# Altium project isokey_right.PrjPcb
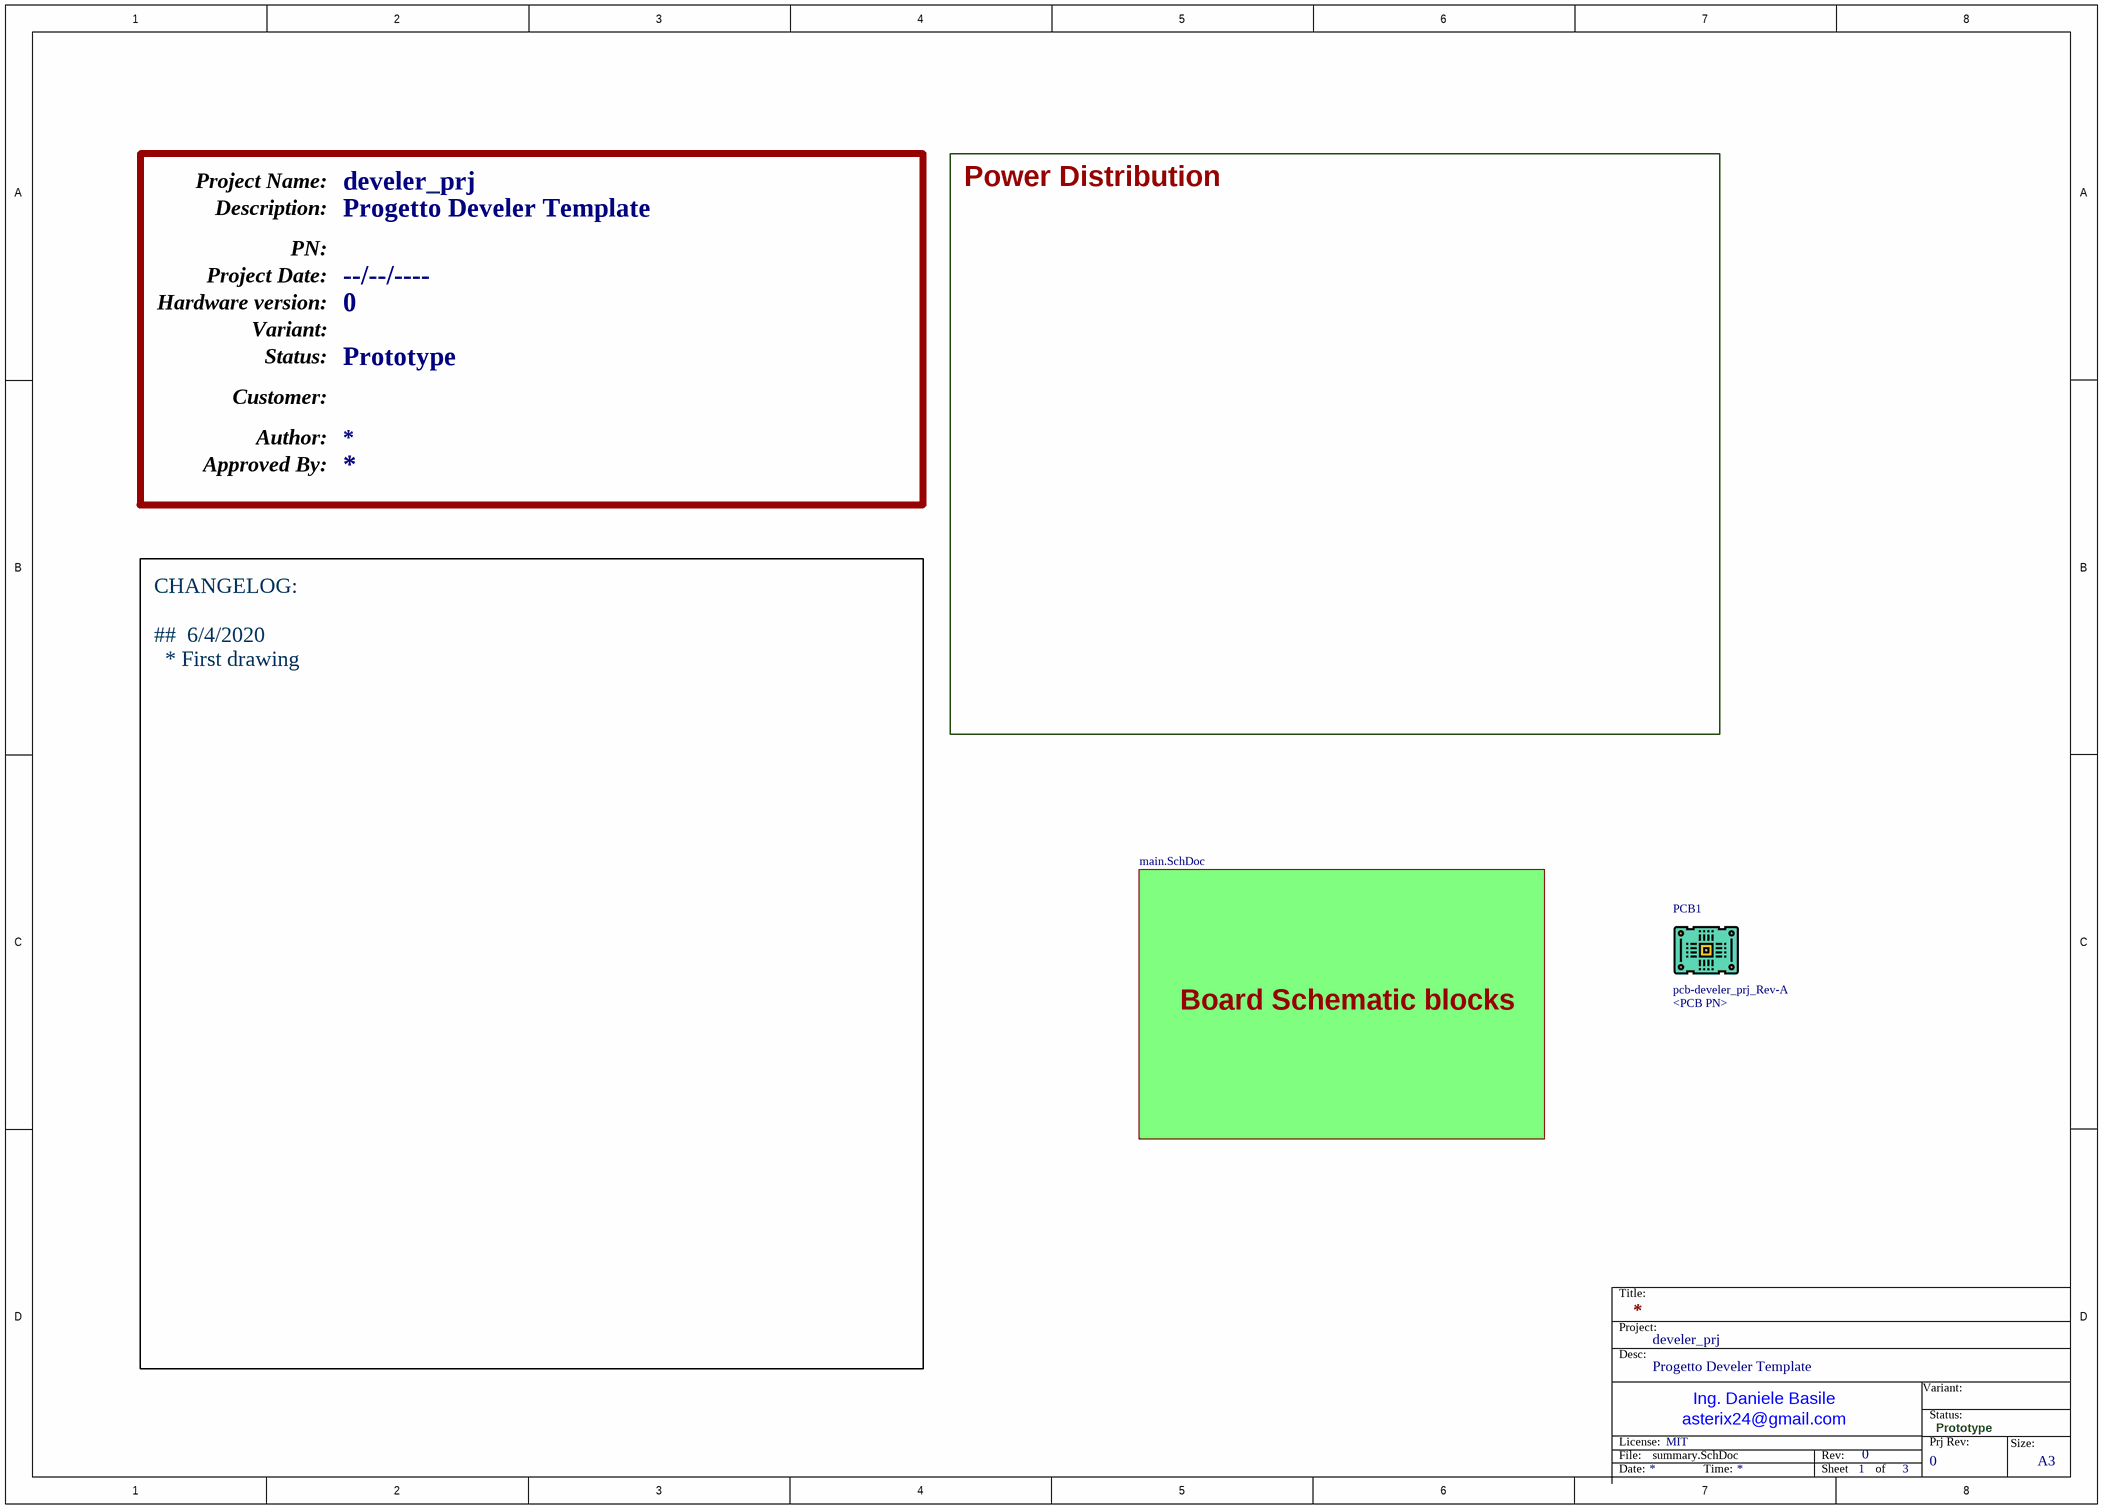
[diagram p0: summary.SchDoc]
prj_status: Prototype; prj_pcb: A; prj_part_number: <PRJ PN>; prj_panel_name: develer_prj_panel; prj_name_long: Progetto Develer Template; prj_name: develer_prj; prj_license: MIT; prj_hw_ver: 0; prj_date: --/--/----; pcb_title2: <TITLE 2>; pcb_title1: <TITLE 1>; pcb_stackup: Default; pcb_solder_color: GREEN; pcb_silkscreen_color: WHITE; pcb_scale: 1:1; pcb_part_number: <PCB PN>; pcb_organization: Develer srl; pcb_material: FR4-Standard Tg 130-140C; pcb_layer_count: 2; pcb_finish: HASL; pcb_engineer_app_date: --/--/----; pcb_engineer: - -----; pcb_dwg_no: <PCB DWG NO>; pcb_designer_app_date: --/--/----; pcb_designer: - -----; pcb_checker_app_date: --/--/----; pcb_checker: - -----; pcb_ang_tol: +/-1/2; pcb_address4: ITALIA; pcb_address3: Firenze; pcb_address2: 50013 Campi Bisenzio; pcb_address1: Via San Quirico 233/3; pcb_3_dec_tol: +/-.010; pcb_2_dec_tol: +/-.01; doc_no_sch_dwg: schematics-xxxx_xxx.pdf; doc_no_fab_dwg: -; doc_no_bom: bom-xxx_xxx.xlsx; doc_no_assy_dwg: assembly-xxxx_xxx.pdf
3 sheets, 169 parts. Net scope: flat (ports and power ports of the same name join across sheets).
Board file: isokey_right.PcbDoc
Sheets:
  summary.SchDoc
     = main.SchDoc
      K00 = key-cell.SchDoc
      K01 = key-cell.SchDoc
      K02 = key-cell.SchDoc
      K03 = key-cell.SchDoc
      K10 = key-cell.SchDoc
      K11 = key-cell.SchDoc
      K12 = key-cell.SchDoc
      K13 = key-cell.SchDoc
      K14 = key-cell.SchDoc
      K20 = key-cell.SchDoc
      K21 = key-cell.SchDoc
      K22 = key-cell.SchDoc
      K23 = key-cell.SchDoc
      K24 = key-cell.SchDoc
      K30 = key-cell.SchDoc
      K31 = key-cell.SchDoc
      K32 = key-cell.SchDoc
      K33 = key-cell.SchDoc
      K40 = key-cell.SchDoc
      K41 = key-cell.SchDoc
      K42 = key-cell.SchDoc
      K43 = key-cell.SchDoc
      K44 = key-cell.SchDoc
      K50 = key-cell.SchDoc
      K51 = key-cell.SchDoc
      K52 = key-cell.SchDoc
      K53 = key-cell.SchDoc
      K60 = key-cell.SchDoc
      K64 = key-cell.SchDoc
      K61 = key-cell.SchDoc
      K62 = key-cell.SchDoc
      K70 = key-cell.SchDoc
      K74 = key-cell.SchDoc
      K72 = key-cell.SchDoc
      K84 = key-cell.SchDoc
      K82 = key-cell.SchDoc
      K73 = key-cell.SchDoc
      K81 = key-cell.SchDoc

## Sheet summary.SchDoc
size A3; Hw_rev: R1; Address3: Firenze; Address4: ITALY; Revision: 0; SheetNumber: 1; SheetTotal: 3

### Parts
PCB1  pcb-develer_prj_Rev-A  CODE Develer: <PCB PN>  (mechanical)

### Sub-sheets
? = main.SchDoc: no entries

### Notes on the sheet
- Project Name:
- Description:
- PN:
- Power Distribution
- Hardware version:
- Project Date:
- Variant:
- Status:
- Author:
- Customer:
- Approved By:
- Board Schematic blocks
- CHANGELOG:
  ##  6/4/2020
  * First drawing
- Title:
- Project:
- Desc:
- File:
- License:
- asterix24@gmail.com
- Ing. Daniele Basile
- Rev:
- Prj Rev:
- Size:
- Date:
- Time:
- Sheet
- of
- A3

### Library data of the parts
PCB1 = PCB: ='['+ pcb_part_number+'], ' + 'pcb-'+prj_name+'_Rev-'+prj_pcb + ', Betamotor'; Publisher: Develer srl; Revision: 0.1; NOTE Manufacturer PN: *; NOTE Manufacturer: *; MountTechnology: *; NOTE Description: *; NOTE Description 2: *

## Sheet main.SchDoc
size A3; Hw_rev: R1; Address3: Firenze; Address4: ITALY; Revision: 0; SheetNumber: 2; SheetTotal: 3
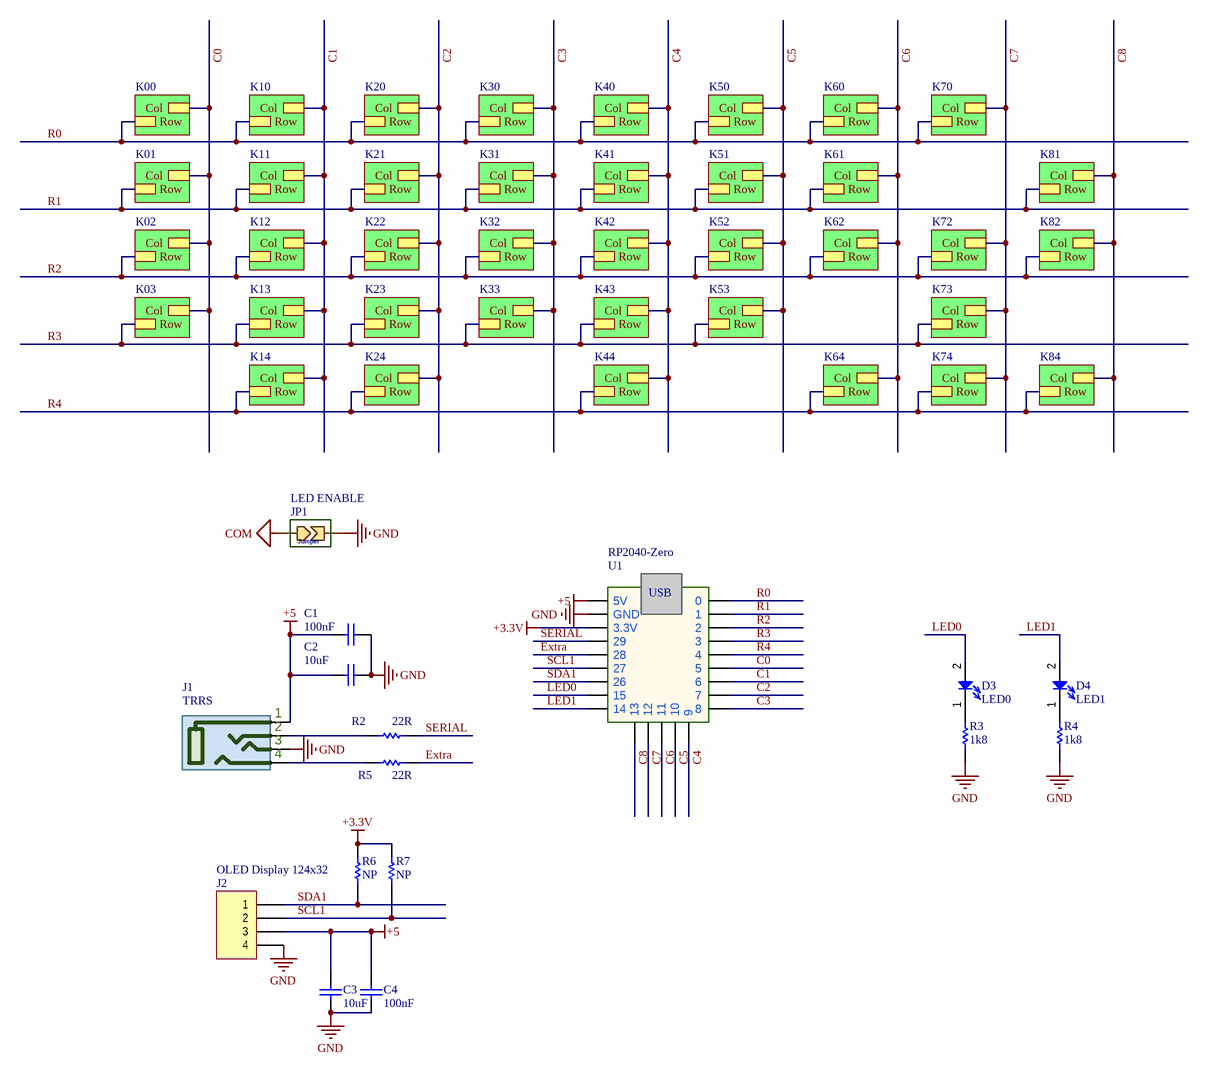
[diagram p1: main.SchDoc]

### Parts
C1  100nF  [0402_[1005]]
C2  10uF  [0603_[1608]]
C3  10uF  [0603_[1608]]
C4  100nF  [0402_[1005]]
D3  LED0  [0402_[1005]_K1-A2_LED]
D4  LED1  [0402_[1005]_K1-A2_LED]
J1  TRRS  [CON_PHONE_TRRS_3.5MM_THD]
J2  OLED Display 124x32  [HEADER_1X4_2.54MM_THD]
JP1  LED ENABLE  [0603_[1608]_JUMPER]
R2  22R  [0402_[1005]]
R3  1k8  [0402_[1005]]
R4  1k8  [0402_[1005]]
R5  22R  [0402_[1005]]
R6  NP  [0402_[1005]]
R7  NP  [0402_[1005]]
U1  RP2040-Zero  [RP2040-Zero]

### Sub-sheets
K00 = key-cell.SchDoc: Col, Row
K01 = key-cell.SchDoc: Col, Row
K02 = key-cell.SchDoc: Col, Row
K03 = key-cell.SchDoc: Col, Row
K10 = key-cell.SchDoc: Col, Row
K11 = key-cell.SchDoc: Col, Row
K12 = key-cell.SchDoc: Col, Row
K13 = key-cell.SchDoc: Col, Row
K14 = key-cell.SchDoc: Col, Row
K20 = key-cell.SchDoc: Col, Row
K21 = key-cell.SchDoc: Col, Row
K22 = key-cell.SchDoc: Col, Row
K23 = key-cell.SchDoc: Col, Row
K24 = key-cell.SchDoc: Col, Row
K30 = key-cell.SchDoc: Col, Row
K31 = key-cell.SchDoc: Col, Row
K32 = key-cell.SchDoc: Col, Row
K33 = key-cell.SchDoc: Col, Row
K40 = key-cell.SchDoc: Col, Row
K41 = key-cell.SchDoc: Col, Row
K42 = key-cell.SchDoc: Col, Row
K43 = key-cell.SchDoc: Col, Row
K44 = key-cell.SchDoc: Col, Row
K50 = key-cell.SchDoc: Col, Row
K51 = key-cell.SchDoc: Col, Row
K52 = key-cell.SchDoc: Col, Row
K53 = key-cell.SchDoc: Col, Row
K60 = key-cell.SchDoc: Col, Row
K61 = key-cell.SchDoc: Col, Row
K62 = key-cell.SchDoc: Col, Row
K64 = key-cell.SchDoc: Col, Row
K70 = key-cell.SchDoc: Col, Row
K72 = key-cell.SchDoc: Col, Row
K73 = key-cell.SchDoc: Col, Row
K74 = key-cell.SchDoc: Col, Row
K81 = key-cell.SchDoc: Col, Row
K82 = key-cell.SchDoc: Col, Row
K84 = key-cell.SchDoc: Col, Row

### Nets
+3.3V: R6.2 R7.2 U1.20(3.3V)
+5: C1.2 C2.2 C3.2 C4.2 J1.1 J2.3 U1.22(5V)
COM: JP1.1
GND: C1.1 C2.1 C3.1 C4.1 J1.3 J2.4 JP1.2 R3.1 R4.1 U1.21(GND)
C0: U1.5 ; sheet K00/Col, sheet K01/Col, sheet K02/Col, sheet K03/Col
C1: U1.6 ; sheet K10/Col, sheet K11/Col, sheet K12/Col, sheet K13/Col, sheet K14/Col
C2: U1.7 ; sheet K20/Col, sheet K21/Col, sheet K22/Col, sheet K23/Col, sheet K24/Col
C3: U1.8 ; sheet K30/Col, sheet K31/Col, sheet K32/Col, sheet K33/Col
C4: U1.9 ; sheet K40/Col, sheet K41/Col, sheet K42/Col, sheet K43/Col, sheet K44/Col
C5: U1.10 ; sheet K50/Col, sheet K51/Col, sheet K52/Col, sheet K53/Col
C6: U1.11 ; sheet K60/Col, sheet K64/Col, sheet K61/Col, sheet K62/Col
C7: U1.12 ; sheet K70/Col, sheet K74/Col, sheet K72/Col, sheet K73/Col
C8: U1.13 ; sheet K84/Col, sheet K82/Col, sheet K81/Col
Extra: R5.1 U1.18(28)
LED0: D3.2(A) U1.15
LED1: D4.2(A) U1.14
R0: U1.0 ; sheet K00/Row, sheet K10/Row, sheet K20/Row, sheet K30/Row, sheet K40/Row, sheet K50/Row, sheet K60/Row, sheet K70/Row
R1: U1.1 ; sheet K01/Row, sheet K11/Row, sheet K21/Row, sheet K31/Row, sheet K41/Row, sheet K51/Row, sheet K61/Row, sheet K81/Row
R2: U1.2 ; sheet K02/Row, sheet K12/Row, sheet K22/Row, sheet K32/Row, sheet K42/Row, sheet K52/Row, sheet K62/Row, sheet K72/Row, sheet K82/Row
R3: U1.3 ; sheet K03/Row, sheet K13/Row, sheet K23/Row, sheet K33/Row, sheet K43/Row, sheet K53/Row, sheet K73/Row
R4: U1.4 ; sheet K14/Row, sheet K24/Row, sheet K44/Row, sheet K64/Row, sheet K74/Row, sheet K84/Row
SCL1: J2.2 R7.1 U1.17(27)
SDA1: J2.1 R6.1 U1.16(26)
SERIAL: R2.1 U1.19(29)
NetD3_1: D3.1(K) R3.2
NetD4_1: D4.1(K) R4.2
NetJ1_2: J1.2 R2.2
NetJ1_4: J1.4 R5.2

### Notes on the sheet
- Title:
- Project:
- Desc:
- Variant:
- File:
- License:
- asterix24@gmail.com
- Ing. Daniele Basile
- Rev:
- Prj Rev:
- Status:
- Size:
- Date:
- Time:
- Sheet
- of
- A3
- (in symbol JumperSMD) Jumper
- (in symbol RP2040-Zero) USB

### Library data of the parts
C1-C4 = Cap: Capacitor; NOTE Manufacturer PN: *; NOTE Manufacturer: *; MountTechnology: *; CODE Develer: *; ComponentLink1Description: New link; ComponentLink1URL: *; NOTE Description: *; NOTE Description 2: *
  C1 C4: Value: 100nF
  C2 C3: Value: 10uF
D3 D4 = DiodeLedSmall: Diode Led; Publisher: Develer srl; Revision: 0.1; NOTE Manufacturer PN: *; NOTE Manufacturer: *; MountTechnology: SMT; CODE Develer: *; NOTE Description: *; NOTE Description 2: *
J1 = CON_PHONE_JACK_TSSR: headphone socket TRRS (Hong Cheng HC-PJ-320A); Publisher: Develer srl; Revision: 0.1; NOTE Manufacturer PN: *; NOTE Manufacturer: *; MountTechnology: SMT; CODE Develer: *; NOTE Description: *; NOTE Description 2: *
J2 = Header 4: Header, 4-Pin; LatestRevisionDate: 17-Jul-2002; LatestRevisionNote: Re-released for DXP Platform.; Publisher: Altium Limited
JP1 = JumperSMD: Jumper SMD; Publisher: Develer srl; Revision: 0.1; NOTE Manufacturer PN: *; NOTE Manufacturer: *; MountTechnology: SMT; CODE Develer: *; NOTE Description: *; NOTE Description 2: *
R2-R7 = Res: Resistor; Publisher: Develer srl; Revision: 0.1; NOTE Manufacturer PN: *; NOTE Manufacturer: *; MountTechnology: SMT; CODE Develer: *; NOTE Description: *; NOTE Description 2: *
U1 = RP2040-Zero: module, mini based on RP4020 (RP2350-Zero); Publisher: Develer srl; Revision: 0.1; NOTE Manufacturer PN: *; NOTE Manufacturer: *; MountTechnology: SMT; CODE Develer: *; NOTE Description: *; NOTE Description 2: *

## Sheet key-cell.SchDoc
size A3; Hw_rev: R1; Address3: Firenze; Address4: ITALY; Revision: 0; SheetNumber: 3; SheetTotal: 3
Used 38 times, as channels /K00, /K01, /K02, /K03, /K10, /K11, /K12, /K13, /K14, /K20, /K21, /K22, /K23, /K24, /K30, /K31, /K32, /K33, /K40, /K41, /K42, /K43, /K44, /K50, /K51, /K52, /K53, /K60, /K64, /K61, /K62, /K70, /K74, /K72, /K84, /K82, /K73, /K81. Parts and nets are listed once, with the designators drawn on the sheet.
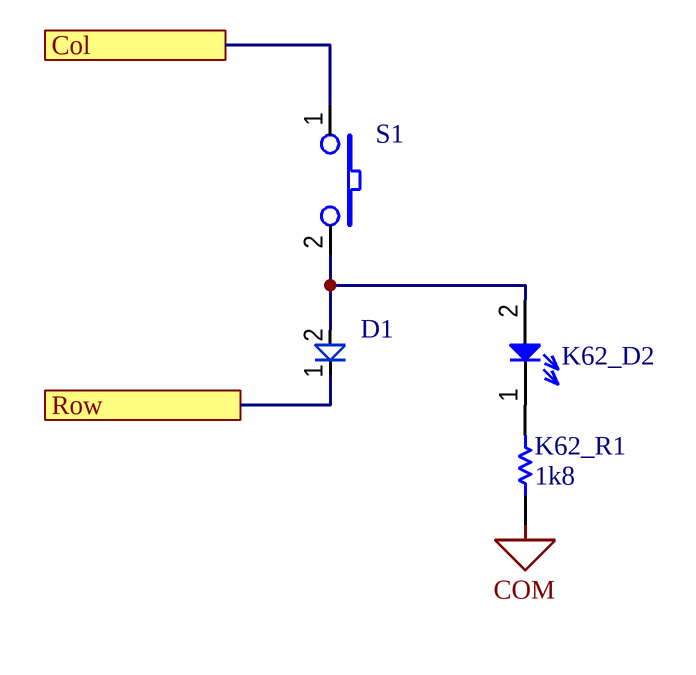
[diagram p2: key-cell.SchDoc]

### Parts
D1  B5819W  [SOD-123_K1-A2]  (value not drawn)
K62_D2  K  [0402_[1005]_K1-A2_LED]  (value not drawn)
K62_R1  1k8  [0402_[1005]]
S1  MecSwitch  [tactile_switch_gateron_pcb]  (value not drawn)

### Ports
Col, Row

### Nets
COM: K62_R1.1
Col: S1.1 ; port Col
Row: D1.1(K) ; port Row
NetD1_2: D1.2(A) K62_D2.2(A) S1.2
NetK62_D2_1: K62_D2.1(K) K62_R1.2

Not connected (* = marked no-connect by the designer): S1 3(GND) 4(GND)

### Channels
/K00: designators D1=K00_D1 K62_D2=K00_D2 K62_R1=K00_R1 S1=K00_S1; ports Col=NetK00_S1_1 Row=NetK00_D1_1
/K01: designators D1=K01_D1 K62_D2=K01_D2 K62_R1=K01_R1 S1=K01_S1; ports Col=NetK00_S1_1 Row=NetK00_D1_1
/K02: designators D1=K02_D1 K62_D2=K02_D2 K62_R1=K02_R1 S1=K02_S1; ports Col=NetK00_S1_1 Row=NetK00_D1_1
/K03: designators D1=K03_D1 K62_D2=K03_D2 K62_R1=K03_R1 S1=K03_S1; ports Col=NetK00_S1_1 Row=NetK00_D1_1
/K10: designators D1=K10_D1 K62_D2=K10_D2 K62_R1=K10_R1 S1=K10_S1; ports Col=NetK00_S1_1 Row=NetK00_D1_1
/K11: designators D1=K11_D1 K62_D2=K11_D2 K62_R1=K11_R1 S1=K11_S1; ports Col=NetK00_S1_1 Row=NetK00_D1_1
/K12: designators D1=K12_D1 K62_D2=K12_D2 K62_R1=K12_R1 S1=K12_S1; ports Col=NetK00_S1_1 Row=NetK00_D1_1
/K13: designators D1=K13_D1 K62_D2=K13_D2 K62_R1=K13_R1 S1=K13_S1; ports Col=NetK00_S1_1 Row=NetK00_D1_1
/K14: designators D1=K14_D1 K62_D2=K14_D2 K62_R1=K14_R1 S1=K14_S1; ports Col=NetK00_S1_1 Row=NetK00_D1_1
/K20: designators D1=K20_D1 K62_D2=K20_D2 K62_R1=K20_R1 S1=K20_S1; ports Col=NetK00_S1_1 Row=NetK00_D1_1
/K21: designators D1=K21_D1 K62_D2=K21_D2 K62_R1=K21_R1 S1=K21_S1; ports Col=NetK00_S1_1 Row=NetK00_D1_1
/K22: designators D1=K22_D1 K62_D2=K22_D2 K62_R1=K22_R1 S1=K22_S1; ports Col=NetK00_S1_1 Row=NetK00_D1_1
/K23: designators D1=K23_D1 K62_D2=K23_D2 K62_R1=K23_R1 S1=K23_S1; ports Col=NetK00_S1_1 Row=NetK00_D1_1
/K24: designators D1=K24_D1 K62_D2=K24_D2 K62_R1=K24_R1 S1=K24_S1; ports Col=NetK00_S1_1 Row=NetK00_D1_1
/K30: designators D1=K30_D1 K62_D2=K30_D2 K62_R1=K30_R1 S1=K30_S1; ports Col=NetK00_S1_1 Row=NetK00_D1_1
/K31: designators D1=K31_D1 K62_D2=K31_D2 K62_R1=K31_R1 S1=K31_S1; ports Col=NetK00_S1_1 Row=NetK00_D1_1
/K32: designators D1=K32_D1 K62_D2=K32_D2 K62_R1=K32_R1 S1=K32_S1; ports Col=NetK00_S1_1 Row=NetK00_D1_1
/K33: designators D1=K33_D1 K62_D2=K33_D2 K62_R1=K33_R1 S1=K33_S1; ports Col=NetK00_S1_1 Row=NetK00_D1_1
/K40: designators D1=K40_D1 K62_D2=K40_D2 K62_R1=K40_R1 S1=K40_S1; ports Col=NetK00_S1_1 Row=NetK00_D1_1
/K41: designators D1=K41_D1 K62_D2=K41_D2 K62_R1=K41_R1 S1=K41_S1; ports Col=NetK00_S1_1 Row=NetK00_D1_1
/K42: designators D1=K42_D1 K62_D2=K42_D2 K62_R1=K42_R1 S1=K42_S1; ports Col=NetK00_S1_1 Row=NetK00_D1_1
/K43: designators D1=K43_D1 K62_D2=K43_D2 K62_R1=K43_R1 S1=K43_S1; ports Col=NetK00_S1_1 Row=NetK00_D1_1
/K44: designators D1=K44_D1 K62_D2=K44_D2 K62_R1=K44_R1 S1=K44_S1; ports Col=NetK00_S1_1 Row=NetK00_D1_1
/K50: designators D1=K50_D1 K62_D2=K50_D2 K62_R1=K50_R1 S1=K50_S1; ports Col=NetK00_S1_1 Row=NetK00_D1_1
/K51: designators D1=K51_D1 K62_D2=K51_D2 K62_R1=K51_R1 S1=K51_S1; ports Col=NetK00_S1_1 Row=NetK00_D1_1
/K52: designators D1=K52_D1 K62_D2=K52_D2 K62_R1=K52_R1 S1=K52_S1; ports Col=NetK00_S1_1 Row=NetK00_D1_1
/K53: designators D1=K53_D1 K62_D2=K53_D2 K62_R1=K53_R1 S1=K53_S1; ports Col=NetK00_S1_1 Row=NetK00_D1_1
/K60: designators D1=K60_D1 K62_D2=K60_D2 K62_R1=K60_R1 S1=K60_S1; ports Col=NetK00_S1_1 Row=NetK00_D1_1
/K64: designators D1=K64_D1 K62_D2=K64_D2 K62_R1=K64_R1 S1=K64_S1; ports Col=NetK00_S1_1 Row=NetK00_D1_1
/K61: designators D1=K61_D1 K62_D2=K61_D2 K62_R1=K61_R1 S1=K61_S1; ports Col=NetK00_S1_1 Row=NetK00_D1_1
/K62: designators D1=K62_D1 K62_D2=K62_D2 K62_R1=K62_R1 S1=K62_S1; ports Col=NetK00_S1_1 Row=NetK00_D1_1
/K70: designators D1=K70_D1 K62_D2=K70_D2 K62_R1=K70_R1 S1=K70_S1; ports Col=NetK00_S1_1 Row=NetK00_D1_1
/K74: designators D1=K74_D1 K62_D2=K74_D2 K62_R1=K74_R1 S1=K74_S1; ports Col=NetK00_S1_1 Row=NetK00_D1_1
/K72: designators D1=K72_D1 K62_D2=K72_D2 K62_R1=K72_R1 S1=K72_S1; ports Col=NetK00_S1_1 Row=NetK00_D1_1
/K84: designators D1=K84_D1 K62_D2=K84_D2 K62_R1=K84_R1 S1=K84_S1; ports Col=NetK00_S1_1 Row=NetK00_D1_1
/K82: designators D1=K82_D1 K62_D2=K82_D2 K62_R1=K82_R1 S1=K82_S1; ports Col=NetK00_S1_1 Row=NetK00_D1_1
/K73: designators D1=K73_D1 K62_D2=K73_D2 K62_R1=K73_R1 S1=K73_S1; ports Col=NetK00_S1_1 Row=NetK00_D1_1
/K81: designators D1=K81_D1 K62_D2=K81_D2 K62_R1=K81_R1 S1=K81_S1; ports Col=NetK00_S1_1 Row=NetK00_D1_1

### Notes on the sheet
- Title:
- Project:
- Desc:
- Variant:
- File:
- License:
- asterix24@gmail.com
- Ing. Daniele Basile
- Rev:
- Prj Rev:
- Status:
- Size:
- Date:
- Time:
- Sheet
- of
- A3

### Library data of the parts
D1 = diode_small: Diode Schottky  low Vf, If 1A ( LCSC `); CODE LCSC: C8598; MountTechnology: SMT
K62_D2 = DiodeLedSmall: Diode Led; Publisher: Develer srl; Revision: 0.1; NOTE Manufacturer PN: *; NOTE Manufacturer: *; MountTechnology: SMT; CODE Develer: *; NOTE Description: *; NOTE Description 2: *
K62_R1 = Res: Resistor; Publisher: Develer srl; Revision: 0.1; NOTE Manufacturer PN: *; NOTE Manufacturer: *; MountTechnology: SMT; CODE Develer: *; NOTE Description: *; NOTE Description 2: *
S1 = SWITCH-RA: Tactile Switch Right Angle 6x6; Part Number: Tyco FSMRA2JH; Purchase Code: RS 479-1520; MountTechnology: THD

## Nets that join several sheets
COM: main (JP1.1), /K00 (K00_R1.1), /K01 (K01_R1.1), /K02 (K02_R1.1), /K03 (K03_R1.1), /K10 (K10_R1.1), /K11 (K11_R1.1), /K12 (K12_R1.1), /K13 (K13_R1.1), /K14 (K14_R1.1), /K20 (K20_R1.1), /K21 (K21_R1.1), /K22 (K22_R1.1), /K23 (K23_R1.1), /K24 (K24_R1.1), /K30 (K30_R1.1), /K31 (K31_R1.1), /K32 (K32_R1.1), /K33 (K33_R1.1), /K40 (K40_R1.1), /K41 (K41_R1.1), /K42 (K42_R1.1), /K43 (K43_R1.1), /K44 (K44_R1.1), /K50 (K50_R1.1), /K51 (K51_R1.1), /K52 (K52_R1.1), /K53 (K53_R1.1), /K60 (K60_R1.1), /K64 (K64_R1.1), /K61 (K61_R1.1), /K62 (K62_R1.1), /K70 (K70_R1.1), /K74 (K74_R1.1), /K72 (K72_R1.1), /K84 (K84_R1.1), /K82 (K82_R1.1), /K73 (K73_R1.1), /K81 (K81_R1.1)
NetK00_D1_1: /K00 (K00_D1.1), /K01 (K01_D1.1), /K02 (K02_D1.1), /K03 (K03_D1.1), /K10 (K10_D1.1), /K11 (K11_D1.1), /K12 (K12_D1.1), /K13 (K13_D1.1), /K14 (K14_D1.1), /K20 (K20_D1.1), /K21 (K21_D1.1), /K22 (K22_D1.1), /K23 (K23_D1.1), /K24 (K24_D1.1), /K30 (K30_D1.1), /K31 (K31_D1.1), /K32 (K32_D1.1), /K33 (K33_D1.1), /K40 (K40_D1.1), /K41 (K41_D1.1), /K42 (K42_D1.1), /K43 (K43_D1.1), /K44 (K44_D1.1), /K50 (K50_D1.1), /K51 (K51_D1.1), /K52 (K52_D1.1), /K53 (K53_D1.1), /K60 (K60_D1.1), /K64 (K64_D1.1), /K61 (K61_D1.1), /K62 (K62_D1.1), /K70 (K70_D1.1), /K74 (K74_D1.1), /K72 (K72_D1.1), /K84 (K84_D1.1), /K82 (K82_D1.1), /K73 (K73_D1.1), /K81 (K81_D1.1)
NetK00_S1_1: /K00 (K00_S1.1), /K01 (K01_S1.1), /K02 (K02_S1.1), /K03 (K03_S1.1), /K10 (K10_S1.1), /K11 (K11_S1.1), /K12 (K12_S1.1), /K13 (K13_S1.1), /K14 (K14_S1.1), /K20 (K20_S1.1), /K21 (K21_S1.1), /K22 (K22_S1.1), /K23 (K23_S1.1), /K24 (K24_S1.1), /K30 (K30_S1.1), /K31 (K31_S1.1), /K32 (K32_S1.1), /K33 (K33_S1.1), /K40 (K40_S1.1), /K41 (K41_S1.1), /K42 (K42_S1.1), /K43 (K43_S1.1), /K44 (K44_S1.1), /K50 (K50_S1.1), /K51 (K51_S1.1), /K52 (K52_S1.1), /K53 (K53_S1.1), /K60 (K60_S1.1), /K64 (K64_S1.1), /K61 (K61_S1.1), /K62 (K62_S1.1), /K70 (K70_S1.1), /K74 (K74_S1.1), /K72 (K72_S1.1), /K84 (K84_S1.1), /K82 (K82_S1.1), /K73 (K73_S1.1), /K81 (K81_S1.1)